# EAGLE schematic AudioPreAmp-LM741 (EAGLE 7.6.0)
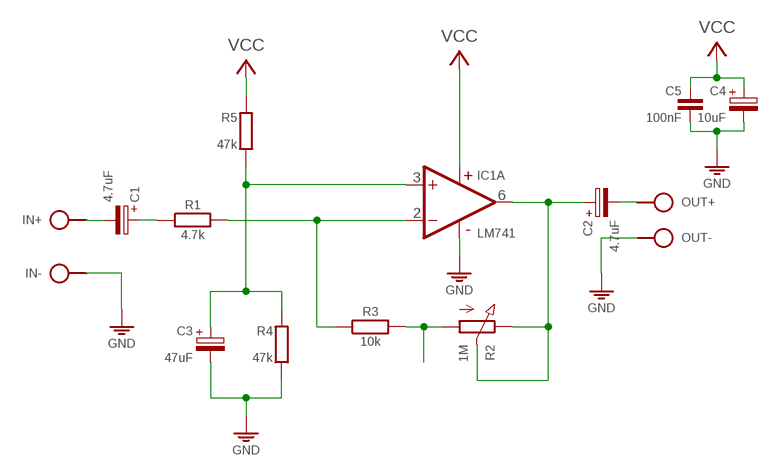
[diagram p0: schematic, sheet 1]

## Parts
C1  4.7uF  CPOLE2,5-4/V  [E2.5-4/V]
C2  4.7uF  CPOLE2,5-4  [E2,5-4]
C3  47uF  CPOLE2,5-4  [E2,5-4]
C4  10uF  CPOLE2,5-4  [E2,5-4]
C5  100nF  C050-020X044/V  [C050-020X044/V]
IC1  LM741  [DIL08]
IN  SPAD+--+  [SPAD-+]
OUT  SPAD+-+-  [SPAD+-]
PWR  VCC_GNDL  [SPAD-+]
R1  4.7k  R-H0204/10  [0204/10]
R2  1M  POT-P5  [POT-P5]
R3  10k  R-H0204/10-V  [0204/10-V]
R4  47k  R0204/10-V  [0204/10-V]
R5  47k  R0204/10  [0204/10]

## Nets
GND: C3.- C4.- C5.2 IC1.4(V-) IN.1 OUT.1 PWR.1 R4.2
N$1: R2.A R3.2
N$2: C1.+ R1.1
N$3: IC1.2(A:-IN) R1.2 R3.1
N$4: C3.+ IC1.3(A:+IN) R4.1 R5.1
N$5: C2.- OUT.2
N$7: C1.- IN.2
N$8: C2.+ IC1.6(A:OUT) R2.E R2.S
VCC: C4.+ C5.1 IC1.7(V+) PWR.2 R5.2

## Library data of the parts
C1-C4 = c:CPOL: POLARIZED CAPACITOR, European symbol
C5 = c:C: CAPACITOR, European symbol
IC1 = ic:LM741
IN OUT = pad:SPAD+-
PWR = pad:VCC_GND
R1 R3 = r:R-H
R2 = r:POT
R4 R5 = r:R: RESISTOR, European symbol